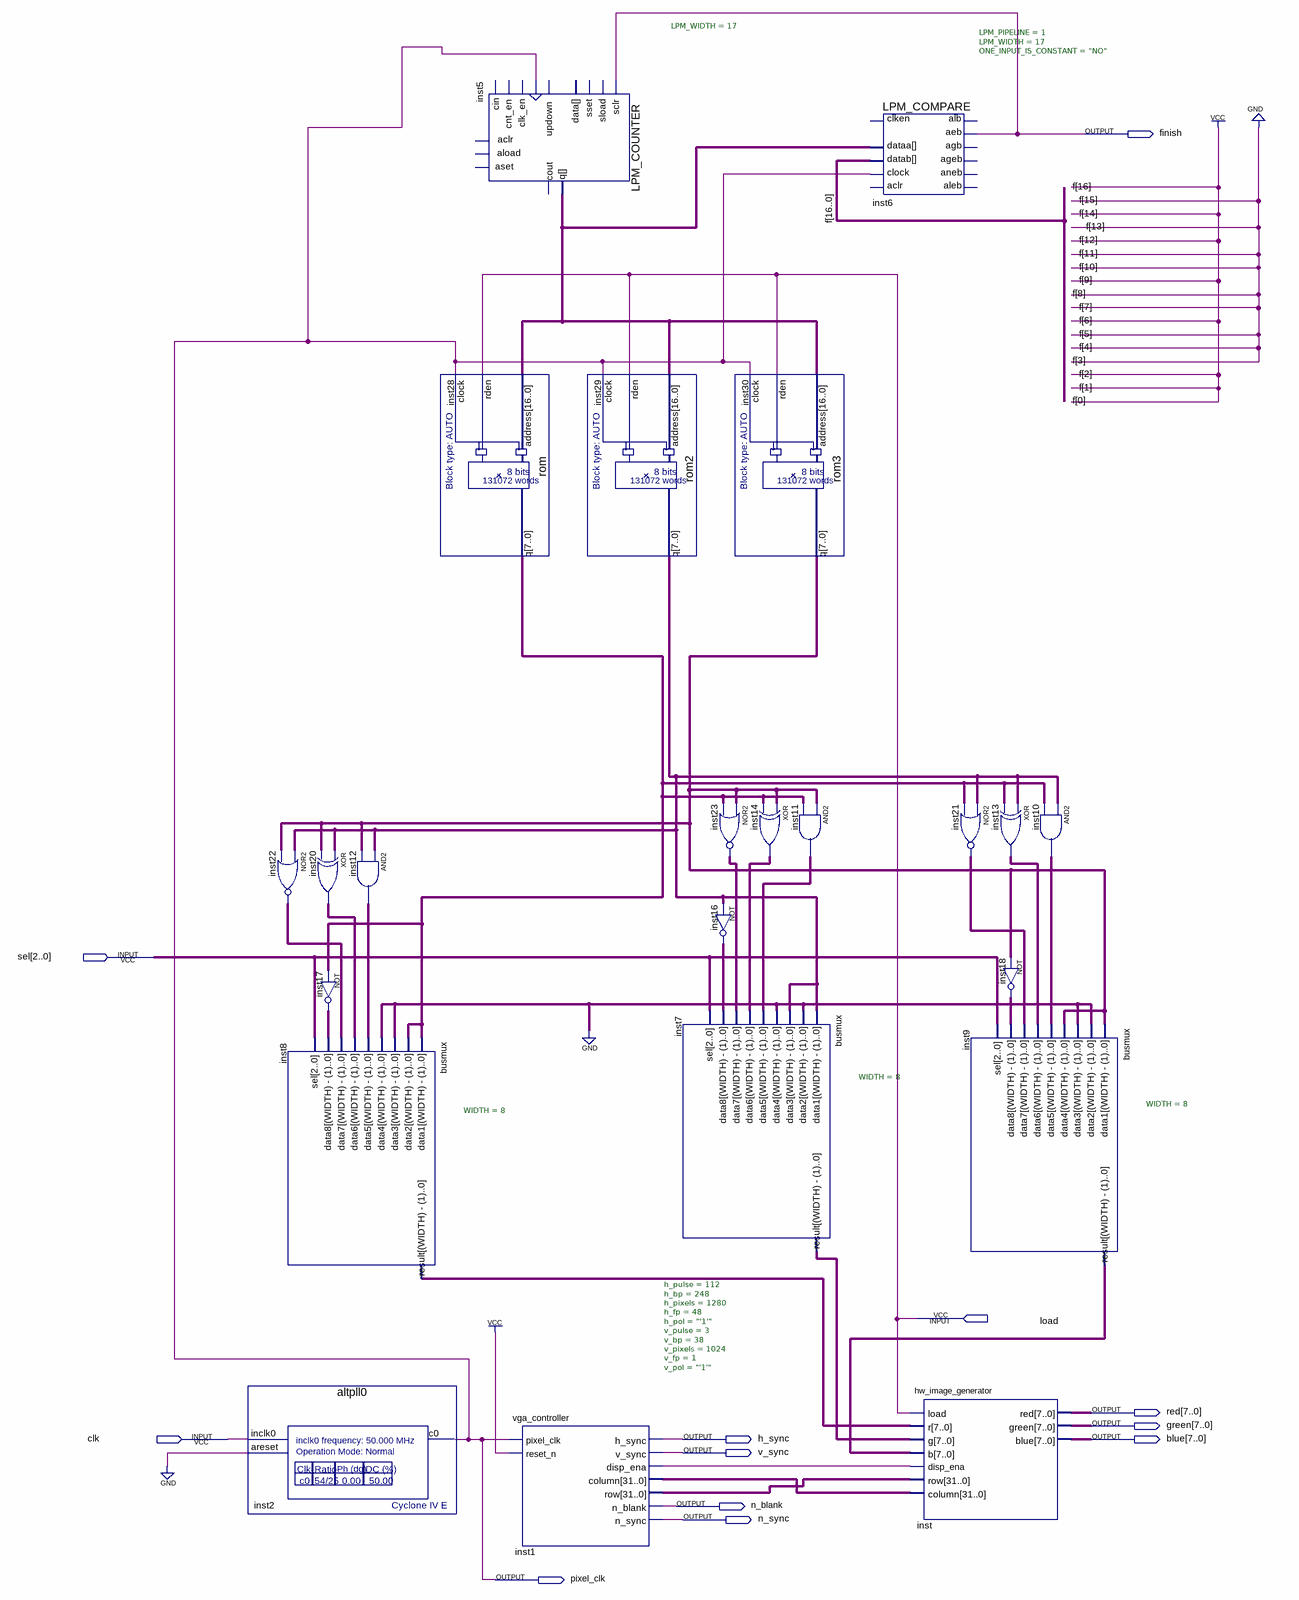
[diagram p0: schematic sheet]
// Quartus schematic vga_with_hw_test_image.bdf as structural Verilog: 23 symbols, 12 pins
module vga_with_hw_test_image (
  input  [2:0] sel,
  input  load,
  input  clk,
  output finish,
  output [7:0] red,
  output [7:0] green,
  output h_sync,
  output [7:0] blue,
  output v_sync,
  output n_blank,
  output n_sync,
  output pixel_clk
);

  wire inst1_disp_ena;
  wire [7:0] inst7_result, inst8_result, inst9_result, inst10_out, inst11_out, inst12_out, inst13_out,
       inst14_out, inst16_out, inst17_out, inst18_out, inst20_out, inst21_out, inst22_out, inst23_out,
       inst28_q, inst29_q, inst30_q;
  wire [16:0] inst5_q;
  wire [31:0] inst1_column, inst1_row;

  assign inst22_out = ~(inst29_q | inst30_q);  // NOR2 inst22, 8 bits wide
  busmux #(.WIDTH(8)) inst8 (
    .data1(inst28_q), .data2(inst28_q), .data3({8{1'b0}}), .data4({8{1'b0}}), .data5(inst12_out),
    .data6(inst20_out), .data7(inst22_out), .data8(inst17_out), .sel(sel), .result(inst8_result));
  altpll0 inst2 (.inclk0(clk), .areset(1'b0), .c0(pixel_clk));
  assign inst20_out = inst29_q ^ inst30_q;  // XOR inst20, 8 bits wide
  assign inst17_out = ~inst28_q;  // NOT inst17, 8 bits wide
  assign inst12_out = inst29_q & inst30_q;  // AND2 inst12, 8 bits wide
  rom inst28 (.address(inst5_q), .rden(load), .clock(pixel_clk), .q(inst28_q));
  LPM_COUNTER #(.LPM_WIDTH(17)) inst5 (
    .clock(pixel_clk), .sclr(finish), .q(inst5_q));  // open: sload, data, clk_en, aload, aclr, aset, cin, sset, updown, cnt_en, cout
  vga_controller #(.h_pulse(112), .h_bp(248), .h_pixels(1280), .h_fp(48), .h_pol("'1'"), .v_pulse(3), .v_bp(38), .v_pixels(1024), .v_fp(1), .v_pol("'1'")) inst1 (
    .pixel_clk(pixel_clk), .reset_n(1'b1), .h_sync(h_sync), .v_sync(v_sync), .disp_ena(inst1_disp_ena),
    .column(inst1_column), .row(inst1_row), .n_blank(n_blank), .n_sync(n_sync));
  rom2 inst29 (.address(inst5_q), .rden(load), .clock(pixel_clk), .q(inst29_q));
  assign inst23_out = ~(inst30_q | inst28_q);  // NOR2 inst23, 8 bits wide
  assign inst16_out = ~inst29_q;  // NOT inst16, 8 bits wide
  busmux #(.WIDTH(8)) inst7 (
    .data1(inst29_q), .data2({8{1'b0}}), .data3(inst29_q), .data4({8{1'b0}}), .data5(inst11_out),
    .data6(inst14_out), .data7(inst23_out), .data8(inst16_out), .sel(sel), .result(inst7_result));
  rom3 inst30 (.address(inst5_q), .rden(load), .clock(pixel_clk), .q(inst30_q));
  assign inst14_out = inst30_q ^ inst28_q;  // XOR inst14, 8 bits wide
  assign inst11_out = inst30_q & inst28_q;  // AND2 inst11, 8 bits wide
  LPM_COMPARE #(.LPM_PIPELINE(1), .LPM_WIDTH(17), .ONE_INPUT_IS_CONSTANT("NO")) inst6 (
    .dataa(inst5_q), .datab(17'b10101001001000111), .clock(pixel_clk), .aeb(finish));  // open: aclr, clken, aleb, agb, aneb, ageb, alb
  hw_image_generator inst (
    .load(load), .r(inst8_result), .g(inst7_result), .b(inst9_result), .disp_ena(inst1_disp_ena),
    .row(inst1_row), .column(inst1_column), .red(red), .green(green), .blue(blue));
  assign inst21_out = ~(inst29_q | inst28_q);  // NOR2 inst21, 8 bits wide
  busmux #(.WIDTH(8)) inst9 (
    .data1(inst30_q), .data2({8{1'b0}}), .data3({8{1'b0}}), .data4(inst30_q), .data5(inst10_out),
    .data6(inst13_out), .data7(inst21_out), .data8(inst18_out), .sel(sel), .result(inst9_result));
  assign inst10_out = inst29_q & inst28_q;  // AND2 inst10, 8 bits wide
  assign inst13_out = inst29_q ^ inst28_q;  // XOR inst13, 8 bits wide
  assign inst18_out = ~inst30_q;  // NOT inst18, 8 bits wide
endmodule
